# Altium project ADH_XC7Z010_SoC.PrjPcb (part 8 of 10)

## Sheet Zynq_DDR_Interface.SchDoc: Zynq DDR Interface
size A4; DrawnBy: Emre Can Damyanlı; Revision: A.1; SheetNumber: 7; SheetTotal: 8; ENG_APP_DATE: --/--/--; DSN_APP_DATE: --/--/--; CHK_APP_DATE: --/--/--
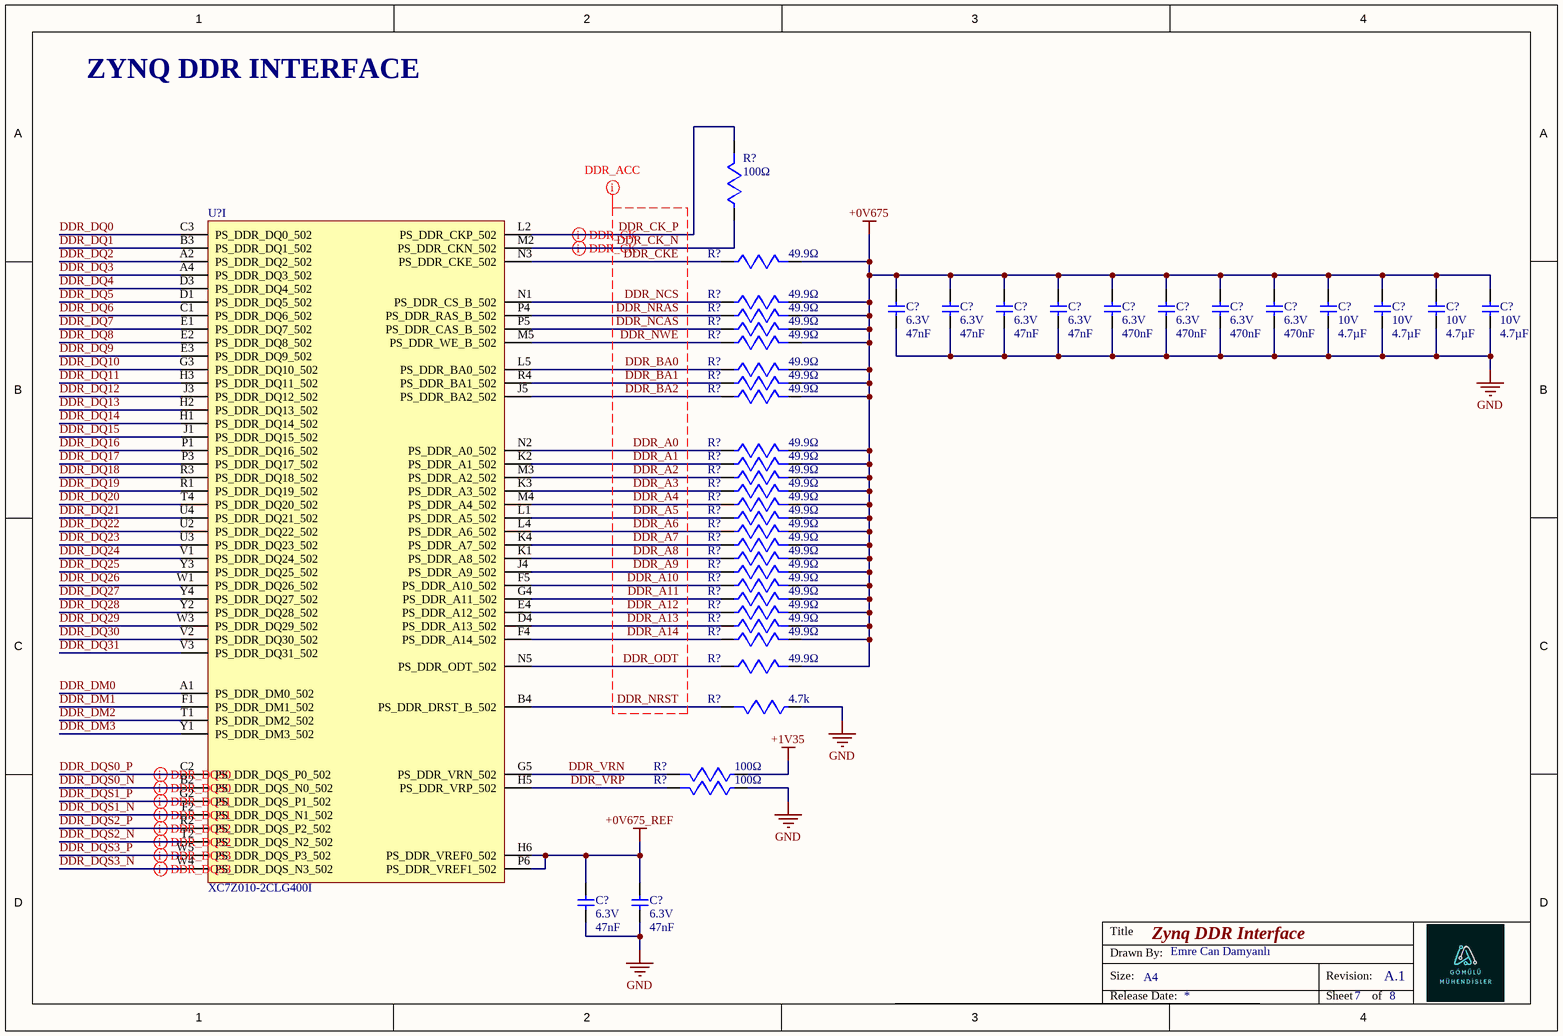
[diagram p6: Zynq_DDR_Interface.SchDoc]

### Parts
(Parts that share a designator on the sheet are numbered #1, #2 ... from top to bottom, then left to right.)
C?#129  value 47nF  Voltage Rating: 6.3V  [CAPC0603X33N]  (hidden comment: GRM033C80J473KE19D)
C?#130  value 47nF  Voltage Rating: 6.3V  [CAPC0603X33N]  (hidden comment: GRM033C80J473KE19D)
C?#131  value 47nF  Voltage Rating: 6.3V  [CAPC0603X33N]  (hidden comment: GRM033C80J473KE19D)
C?#132  value 47nF  Voltage Rating: 6.3V  [CAPC0603X33N]  (hidden comment: GRM033C80J473KE19D)
C?#133  value 470nF  Voltage Rating: 6.3V  [CAPC0603X33N]  (hidden comment: GRM033R60J474KE90D)
C?#134  value 470nF  Voltage Rating: 6.3V  [CAPC0603X33N]  (hidden comment: GRM033R60J474KE90D)
C?#135  value 470nF  Voltage Rating: 6.3V  [CAPC0603X33N]  (hidden comment: GRM033R60J474KE90D)
C?#136  value 470nF  Voltage Rating: 6.3V  [CAPC0603X33N]  (hidden comment: GRM033R60J474KE90D)
C?#137  value 4.7µF  Voltage Rating: 10V  [CAPC1005X55N]  (hidden comment: CL05A475MP5NRNC)
C?#138  value 4.7µF  Voltage Rating: 10V  [CAPC1005X55N]  (hidden comment: CL05A475MP5NRNC)
C?#139  value 4.7µF  Voltage Rating: 10V  [CAPC1005X55N]  (hidden comment: CL05A475MP5NRNC)
C?#140  value 4.7µF  Voltage Rating: 10V  [CAPC1005X55N]  (hidden comment: CL05A475MP5NRNC)
C?#141  value 47nF  Voltage Rating: 6.3V  [CAPC0603X33N]  (hidden comment: GRM033C80J473KE19D)
C?#142  value 47nF  Voltage Rating: 6.3V  [CAPC0603X33N]  (hidden comment: GRM033C80J473KE19D)
R?#106  value 100Ω  [RESISTOR_0603]  (hidden comment: RC0603FR-07100RL)
R?#107  value 49.9Ω  [RESISTOR_0603]  (hidden comment: RC0603FR-0749R9L)
R?#108  value 49.9Ω  [RESISTOR_0603]  (hidden comment: RC0603FR-0749R9L)
R?#109  value 49.9Ω  [RESISTOR_0603]  (hidden comment: RC0603FR-0749R9L)
R?#110  value 49.9Ω  [RESISTOR_0603]  (hidden comment: RC0603FR-0749R9L)
R?#111  value 49.9Ω  [RESISTOR_0603]  (hidden comment: RC0603FR-0749R9L)
R?#112  value 49.9Ω  [RESISTOR_0603]  (hidden comment: RC0603FR-0749R9L)
R?#113  value 49.9Ω  [RESISTOR_0603]  (hidden comment: RC0603FR-0749R9L)
R?#114  value 49.9Ω  [RESISTOR_0603]  (hidden comment: RC0603FR-0749R9L)
R?#115  value 49.9Ω  [RESISTOR_0603]  (hidden comment: RC0603FR-0749R9L)
R?#116  value 49.9Ω  [RESISTOR_0603]  (hidden comment: RC0603FR-0749R9L)
R?#117  value 49.9Ω  [RESISTOR_0603]  (hidden comment: RC0603FR-0749R9L)
R?#118  value 49.9Ω  [RESISTOR_0603]  (hidden comment: RC0603FR-0749R9L)
R?#119  value 49.9Ω  [RESISTOR_0603]  (hidden comment: RC0603FR-0749R9L)
R?#120  value 49.9Ω  [RESISTOR_0603]  (hidden comment: RC0603FR-0749R9L)
R?#121  value 49.9Ω  [RESISTOR_0603]  (hidden comment: RC0603FR-0749R9L)
R?#122  value 49.9Ω  [RESISTOR_0603]  (hidden comment: RC0603FR-0749R9L)
R?#123  value 49.9Ω  [RESISTOR_0603]  (hidden comment: RC0603FR-0749R9L)
R?#124  value 49.9Ω  [RESISTOR_0603]  (hidden comment: RC0603FR-0749R9L)
R?#125  value 49.9Ω  [RESISTOR_0603]  (hidden comment: RC0603FR-0749R9L)
R?#126  value 49.9Ω  [RESISTOR_0603]  (hidden comment: RC0603FR-0749R9L)
R?#127  value 49.9Ω  [RESISTOR_0603]  (hidden comment: RC0603FR-0749R9L)
R?#128  value 49.9Ω  [RESISTOR_0603]  (hidden comment: RC0603FR-0749R9L)
R?#129  value 49.9Ω  [RESISTOR_0603]  (hidden comment: RC0603FR-0749R9L)
R?#130  value 49.9Ω  [RESISTOR_0603]  (hidden comment: RC0603FR-0749R9L)
R?#131  value 4.7k  [RESISTOR_0603]  (hidden comment: RC0603FR-074K7L)
R?#132  value 100Ω  [RESISTOR_0603]  (hidden comment: RC0603FR-07100RL)
R?#133  value 100Ω  [RESISTOR_0603]  (hidden comment: RC0603FR-07100RL)
U?#22  XC7Z010-2CLG400I  [BGA400C80P20X20_1700X1700X160]  (part I of 9)

### Nets
+0V675: C?#129.2 C?#130.2 C?#131.2 C?#132.2 C?#133.2 C?#134.2 C?#135.2 C?#136.2 C?#137.2 C?#138.2 C?#139.2 C?#140.2 R?#107.2 R?#108.2 R?#109.2 R?#110.2 R?#111.2 R?#112.2 R?#113.2 R?#114.2 R?#115.2 R?#116.2 R?#117.2 R?#118.2 R?#119.2 R?#120.2 R?#121.2 R?#122.2 R?#123.2 R?#124.2 R?#125.2 R?#126.2 R?#127.2 R?#128.2 R?#129.2 R?#130.2
+0V675_REF: C?#141.2 C?#142.2 U?#22.H6(PS_DDR_VREF0_502) U?#22.P6(PS_DDR_VREF1_502)
+1V35: R?#132.1
GND: C?#129.1 C?#130.1 C?#131.1 C?#132.1 C?#133.1 C?#134.1 C?#135.1 C?#136.1 C?#137.1 C?#138.1 C?#139.1 C?#140.1 C?#141.1 C?#142.1 R?#131.1 R?#133.1
DDR_A0: R?#115.1 U?#22.N2(PS_DDR_A0_502)
DDR_A1: R?#116.1 U?#22.K2(PS_DDR_A1_502)
DDR_A2: R?#117.1 U?#22.M3(PS_DDR_A2_502)
DDR_A3: R?#118.1 U?#22.K3(PS_DDR_A3_502)
DDR_A4: R?#119.1 U?#22.M4(PS_DDR_A4_502)
DDR_A5: R?#120.1 U?#22.L1(PS_DDR_A5_502)
DDR_A6: R?#121.1 U?#22.L4(PS_DDR_A6_502)
DDR_A7: R?#122.1 U?#22.K4(PS_DDR_A7_502)
DDR_A8: R?#123.1 U?#22.K1(PS_DDR_A8_502)
DDR_A9: R?#124.1 U?#22.J4(PS_DDR_A9_502)
DDR_A10: R?#125.1 U?#22.F5(PS_DDR_A10_502)
DDR_A11: R?#126.1 U?#22.G4(PS_DDR_A11_502)
DDR_A12: R?#127.1 U?#22.E4(PS_DDR_A12_502)
DDR_A13: R?#128.1 U?#22.D4(PS_DDR_A13_502)
DDR_A14: R?#129.1 U?#22.F4(PS_DDR_A14_502)
DDR_BA0: R?#112.1 U?#22.L5(PS_DDR_BA0_502)
DDR_BA1: R?#113.1 U?#22.R4(PS_DDR_BA1_502)
DDR_BA2: R?#114.1 U?#22.J5(PS_DDR_BA2_502)
DDR_CK_N: R?#106.1 U?#22.M2(PS_DDR_CKN_502)
DDR_CK_P: R?#106.2 U?#22.L2(PS_DDR_CKP_502)
DDR_CKE: R?#107.1 U?#22.N3(PS_DDR_CKE_502)
DDR_DM0: U?#22.A1(PS_DDR_DM0_502)
DDR_DM1: U?#22.F1(PS_DDR_DM1_502)
DDR_DM2: U?#22.T1(PS_DDR_DM2_502)
DDR_DM3: U?#22.Y1(PS_DDR_DM3_502)
DDR_DQ0: U?#22.C3(PS_DDR_DQ0_502)
DDR_DQ1: U?#22.B3(PS_DDR_DQ1_502)
DDR_DQ2: U?#22.A2(PS_DDR_DQ2_502)
DDR_DQ3: U?#22.A4(PS_DDR_DQ3_502)
DDR_DQ4: U?#22.D3(PS_DDR_DQ4_502)
DDR_DQ5: U?#22.D1(PS_DDR_DQ5_502)
DDR_DQ6: U?#22.C1(PS_DDR_DQ6_502)
DDR_DQ7: U?#22.E1(PS_DDR_DQ7_502)
DDR_DQ8: U?#22.E2(PS_DDR_DQ8_502)
DDR_DQ9: U?#22.E3(PS_DDR_DQ9_502)
DDR_DQ10: U?#22.G3(PS_DDR_DQ10_502)
DDR_DQ11: U?#22.H3(PS_DDR_DQ11_502)
DDR_DQ12: U?#22.J3(PS_DDR_DQ12_502)
DDR_DQ13: U?#22.H2(PS_DDR_DQ13_502)
DDR_DQ14: U?#22.H1(PS_DDR_DQ14_502)
DDR_DQ15: U?#22.J1(PS_DDR_DQ15_502)
DDR_DQ16: U?#22.P1(PS_DDR_DQ16_502)
DDR_DQ17: U?#22.P3(PS_DDR_DQ17_502)
DDR_DQ18: U?#22.R3(PS_DDR_DQ18_502)
DDR_DQ19: U?#22.R1(PS_DDR_DQ19_502)
DDR_DQ20: U?#22.T4(PS_DDR_DQ20_502)
DDR_DQ21: U?#22.U4(PS_DDR_DQ21_502)
DDR_DQ22: U?#22.U2(PS_DDR_DQ22_502)
DDR_DQ23: U?#22.U3(PS_DDR_DQ23_502)
DDR_DQ24: U?#22.V1(PS_DDR_DQ24_502)
DDR_DQ25: U?#22.Y3(PS_DDR_DQ25_502)
DDR_DQ26: U?#22.W1(PS_DDR_DQ26_502)
DDR_DQ27: U?#22.Y4(PS_DDR_DQ27_502)
DDR_DQ28: U?#22.Y2(PS_DDR_DQ28_502)
DDR_DQ29: U?#22.W3(PS_DDR_DQ29_502)
DDR_DQ30: U?#22.V2(PS_DDR_DQ30_502)
DDR_DQ31: U?#22.V3(PS_DDR_DQ31_502)
DDR_DQS0_N: U?#22.B2(PS_DDR_DQS_N0_502)
DDR_DQS0_P: U?#22.C2(PS_DDR_DQS_P0_502)
DDR_DQS1_N: U?#22.F2(PS_DDR_DQS_N1_502)
DDR_DQS1_P: U?#22.G2(PS_DDR_DQS_P1_502)
DDR_DQS2_N: U?#22.T2(PS_DDR_DQS_N2_502)
DDR_DQS2_P: U?#22.R2(PS_DDR_DQS_P2_502)
DDR_DQS3_N: U?#22.W4(PS_DDR_DQS_N3_502)
DDR_DQS3_P: U?#22.W5(PS_DDR_DQS_P3_502)
DDR_NCAS: R?#110.1 U?#22.P5(PS_DDR_CAS_B_502)
DDR_NCS: R?#108.1 U?#22.N1(PS_DDR_CS_B_502)
DDR_NRAS: R?#109.1 U?#22.P4(PS_DDR_RAS_B_502)
DDR_NRST: R?#131.2 U?#22.B4(PS_DDR_DRST_B_502)
DDR_NWE: R?#111.1 U?#22.M5(PS_DDR_WE_B_502)
DDR_ODT: R?#130.1 U?#22.N5(PS_DDR_ODT_502)
DDR_VRN: R?#132.2 U?#22.G5(PS_DDR_VRN_502)
DDR_VRP: R?#133.2 U?#22.H5(PS_DDR_VRP_502)

### Layout directives
differential pair: DDR_CK_N, DDR_CK_P, DDR_DQS0_N, DDR_DQS0_P, DDR_DQS1_N, DDR_DQS1_P, DDR_DQS2_N, DDR_DQS2_P, DDR_DQS3_N, DDR_DQS3_P
mark named DDR_ACC: DDR_A0, DDR_A1, DDR_A2, DDR_A3, DDR_A4, DDR_A5, DDR_A6, DDR_A7, DDR_A8, DDR_A9, DDR_A10, DDR_A11, DDR_A12, DDR_A13, DDR_A14, DDR_BA0, DDR_BA1, DDR_BA2, DDR_CK_N, DDR_CK_P, DDR_CKE, DDR_NCAS, DDR_NCS, DDR_NRAS, DDR_NRST, DDR_NWE, DDR_ODT

### Notes on the sheet
- ZYNQ DDR INTERFACE
- Title
- Size:
- Drawn By:
- A4
- Revision:
- Release Date:
- Sheet
- of

### Library data of the parts
C?#129-C?#132 C?#141 C?#142 = GRM033C80J473KE19D: 6.3V 47nF X6S ±10% 0201 Multilayer Ceramic Capacitors MLCC - SMD/SMT ROHS; Manufacturer: Murata; Manufacturer Lifecycle Status: IN PRODUCTION; Supplier: Arrow Electronics; Supplier Part Number: GRM033C80J473KE19D; Manufacturer Part Number: GRM033C80J473KE19D; RoHS: Compliant; Category: Ceramic Capacitors; Stock: 1925; Pricing: 1924=0,0007 (USD); Case/Package: 0201; Case Code (Imperial): 0201; Case Code (Metric): 0603; Depth: 300µm; Dielectric: X6S; Dielectric Material: Ceramic; Height: 300µm; Lead Free: Lead Free; Length: 600µm; Lifecycle Status: Production; Material: Ceramic; Max Operating Temperature: 105°C; Min Operating Temperature: -55°C; Mounting Technology: Surface Mount; Number of Terminals: 2; Radiation Hardening: No; REACH SVHC: Yes; Schedule B: 8532240020, 8532240020|8532240020|8532240020|8532240020|8532240020; Termination: SMD/SMT; Thickness: 300µm; Tolerance: 10%; Voltage Rating (DC): 6.3V; Width: 300µm; ComponentLink1URL: https://datasheet.octopart.com:443/GRM033C80J473KE19D-Murata-datasheet-14396169.pdf?src-supplier=Future+Electronics; ComponentLink1Description: https://datasheet.octopart.com:443/GRM033C80J473KE19D-Murata-datasheet-14396169.pdf?src-supplier=Future+Electronics; ComponentLink2URL: https://datasheet.octopart.com:443/GRM033C80J473KE19D-Murata-datasheet-96971104.pdf?src-supplier=Future+Electronics; ComponentLink2Description: https://datasheet.octopart.com:443/GRM033C80J473KE19D-Murata-datasheet-96971104.pdf?src-supplier=Future+Electronics; ComponentLink3URL: https://datasheet.octopart.com:443/GRM033C80J473KE19D-Murata-datasheet-22122223.pdf?src-supplier=Future+Electronics; ComponentLink3Description: https://datasheet.octopart.com:443/GRM033C80J473KE19D-Murata-datasheet-22122223.pdf?src-supplier=Future+Electronics; ComponentLink4URL: https://datasheet.octopart.com:443/GRM033C80J473KE19D-Murata-datasheet-44105362.pdf?src-supplier=Future+Electronics; ComponentLink4Description: https://datasheet.octopart.com:443/GRM033C80J473KE19D-Murata-datasheet-44105362.pdf?src-supplier=Future+Electronics; ComponentLink5URL: https://datasheet.octopart.com:443/GRM033C80J473KE19D-Murata-datasheet-165579666.pdf?src-supplier=TME; ComponentLink5Description: https://datasheet.octopart.com:443/GRM033C80J473KE19D-Murata-datasheet-165579666.pdf?src-supplier=TME; ComponentLink6URL: https://datasheet.octopart.com:443/GRM033C80J473KE19D-Murata-datasheet-141274201.pdf?src-supplier=Ciiva; ComponentLink6Description: https://datasheet.octopart.com:443/GRM033C80J473KE19D-Murata-datasheet-141274201.pdf?src-supplier=Ciiva; ComponentLink7URL: https://datasheet.octopart.com:443/GRM033C80J473KE19D-Murata-datasheet-140675416.pdf?src-supplier=Ciiva; ComponentLink7Description: https://datasheet.octopart.com:443/GRM033C80J473KE19D-Murata-datasheet-140675416.pdf?src-supplier=Ciiva; ComponentLink8URL: https://datasheet.octopart.com:443/GRM033C80J473KE19D-Murata-datasheet-138738209.pdf?src-supplier=Ciiva; ComponentLink8Description: https://datasheet.octopart.com:443/GRM033C80J473KE19D-Murata-datasheet-138738209.pdf?src-supplier=Ciiva; ComponentLink9URL: https://datasheet.octopart.com:443/GRM033C80J473KE19D-Murata-datasheet-32479577.pdf?src-supplier=HQonline; ComponentLink9Description: https://datasheet.octopart.com:443/GRM033C80J473KE19D-Murata-datasheet-32479577.pdf?src-supplier=HQonline; ComponentLink10URL: https://datasheet.octopart.com/GRM033C80J473KE19D-Murata-datasheet-12515295.pdf; ComponentLink10Description: https://datasheet.octopart.com/GRM033C80J473KE19D-Murata-datasheet-12515295.pdf; ComponentLink11URL: https://datasheet.octopart.com/GRM033C80J473KE19D-Murata-datasheet-12510076.pdf; ComponentLink11Description: https://datasheet.octopart.com/GRM033C80J473KE19D-Murata-datasheet-12510076.pdf; ComponentLink12URL: https://datasheet.octopart.com/GRM033C80J473KE19D-Murata-datasheet-11978611.pdf; ComponentLink12Description: https://datasheet.octopart.com/GRM033C80J473KE19D-Murata-datasheet-11978611.pdf; ComponentLink13URL: https://datasheet.octopart.com/GRM033C80J473KE19D-Murata-datasheet-10025737.pdf; ComponentLink13Description: https://datasheet.octopart.com/GRM033C80J473KE19D-Murata-datasheet-10025737.pdf; ComponentLink14URL: https://datasheet.octopart.com/GRM033C80J473KE19D-Murata-datasheet-8819587.pdf; ComponentLink14Description: https://datasheet.octopart.com/GRM033C80J473KE19D-Murata-datasheet-8819587.pdf; ComponentLink15URL: https://datasheet.octopart.com:443/GRM033C80J473KE19D-Murata-datasheet-150009104.pdf?src-supplier=Arrow.cn; ComponentLink15Description: https://datasheet.octopart.com:443/GRM033C80J473KE19D-Murata-datasheet-150009104.pdf?src-supplier=Arrow.cn; ComponentLink16URL: http://sigma.octopart.com:80/reach_statement/Murata-company-16.pdf?src-supplier=Compliance+Statements; ComponentLink16Description: http://sigma.octopart.com:80/reach_statement/Murata-company-16.pdf?src-supplier=Compliance+Statements
C?#133-C?#136 = GRM033R60J474KE90D: Ceramic Capacitor, Ceramic, 6.3V, 10% +Tol, 10% -Tol, X5R, 15% TC, 0.47uF, Surface Mount, 0201; Manufacturer: Murata; Manufacturer Lifecycle Status: IN PRODUCTION; Supplier: Arrow Electronics; Supplier Part Number: GRM033R60J474KE90D; Manufacturer Part Number: GRM033R60J474KE90D; RoHS: Compliant; Category: Ceramic Capacitors; Stock: 1170000; Pricing: 15000=0,004 (USD); Case/Package: 0201; Case Code (Imperial): 0201; Case Code (Metric): 0603; Depth: 300µm; Dielectric: X5R; Dielectric Material: Ceramic; Height: 300µm; Lead Free: Lead Free; Length: 600µm; Lifecycle Status: Production; Material: Ceramic; Max Operating Temperature: 85°C; Min Operating Temperature: -55°C; Mounting Technology: Surface Mount; Number of Terminals: 2; Packaging: Tape & Reel (TR); REACH SVHC: Yes; Schedule B: 8532240020, 8532240020|8532240020, 8532240020|8532240020|8532240020, 8532240020|8532240020|8532240020|8532240020; Termination: SMD/SMT; Thickness: 300µm; Tolerance: 10%; Voltage Rating (DC): 6.3V; Weight: 340.194278µg; Width: 300µm; ComponentLink1URL: https://datasheet.octopart.com:443/GRM033R60J474KE90D-Murata-datasheet-165579666.pdf?src-supplier=TME; ComponentLink1Description: https://datasheet.octopart.com:443/GRM033R60J474KE90D-Murata-datasheet-165579666.pdf?src-supplier=TME; ComponentLink2URL: https://datasheet.octopart.com:443/GRM033R60J474KE90D-Murata-datasheet-141274201.pdf?src-supplier=Ciiva; ComponentLink2Description: https://datasheet.octopart.com:443/GRM033R60J474KE90D-Murata-datasheet-141274201.pdf?src-supplier=Ciiva; ComponentLink3URL: https://datasheet.octopart.com:443/GRM033R60J474KE90D-Murata-datasheet-140676048.pdf?src-supplier=Ciiva; ComponentLink3Description: https://datasheet.octopart.com:443/GRM033R60J474KE90D-Murata-datasheet-140676048.pdf?src-supplier=Ciiva; ComponentLink4URL: https://datasheet.octopart.com:443/GRM033R60J474KE90D-Murata-datasheet-138738366.pdf?src-supplier=Ciiva; ComponentLink4Description: https://datasheet.octopart.com:443/GRM033R60J474KE90D-Murata-datasheet-138738366.pdf?src-supplier=Ciiva; ComponentLink5URL: https://datasheet.octopart.com:443/GRM033R60J474KE90D-Murata-datasheet-22122223.pdf?src-supplier=Future+Electronics; ComponentLink5Description: https://datasheet.octopart.com:443/GRM033R60J474KE90D-Murata-datasheet-22122223.pdf?src-supplier=Future+Electronics; ComponentLink6URL: https://datasheet.octopart.com/GRM033R60J474KE90D-Murata-datasheet-12515295.pdf; ComponentLink6Description: https://datasheet.octopart.com/GRM033R60J474KE90D-Murata-datasheet-12515295.pdf; ComponentLink7URL: https://datasheet.octopart.com/GRM033R60J474KE90D-Murata-datasheet-12510076.pdf; ComponentLink7Description: https://datasheet.octopart.com/GRM033R60J474KE90D-Murata-datasheet-12510076.pdf; ComponentLink8URL: https://datasheet.octopart.com/GRM033R60J474KE90D-Murata-datasheet-11978611.pdf; ComponentLink8Description: https://datasheet.octopart.com/GRM033R60J474KE90D-Murata-datasheet-11978611.pdf; ComponentLink9URL: https://datasheet.octopart.com/GRM033R60J474KE90D-Murata-datasheet-10025737.pdf; ComponentLink9Description: https://datasheet.octopart.com/GRM033R60J474KE90D-Murata-datasheet-10025737.pdf; ComponentLink10URL: https://datasheet.octopart.com/GRM033R60J474KE90D-Murata-datasheet-8819587.pdf; ComponentLink10Description: https://datasheet.octopart.com/GRM033R60J474KE90D-Murata-datasheet-8819587.pdf; ComponentLink11URL: https://datasheet.octopart.com/GRM033R60J474KE90D-Murata-datasheet-17503195.pdf; ComponentLink11Description: https://datasheet.octopart.com/GRM033R60J474KE90D-Murata-datasheet-17503195.pdf; ComponentLink12URL: https://datasheet.octopart.com:443/GRM033R60J474KE90D-Murata-datasheet-150839311.pdf?src-supplier=Arrow.cn; ComponentLink12Description: https://datasheet.octopart.com:443/GRM033R60J474KE90D-Murata-datasheet-150839311.pdf?src-supplier=Arrow.cn; ComponentLink13URL: http://sigma.octopart.com:80/reach_statement/Murata-company-16.pdf?src-supplier=Compliance+Statements; ComponentLink13Description: http://sigma.octopart.com:80/reach_statement/Murata-company-16.pdf?src-supplier=Compliance+Statements
C?#137-C?#140 = CL05A475MP5NRNC: as C?#123-C?#125 on sheet Zynq_PS_System; Supplier: Avnet; Supplier Part Number: CL05A475MP5NRNC; Manufacturer Part Number: CL05A475MP5NRNC; RoHS: Compliant; Category: Ceramic Capacitors; Stock: 40000; Pricing: 10000=0,00671, 20000=0,00663, 40000=0,0066, 80000=0,00656, 160000=0,00653 (USD); Case/Package: 0402; Case Code (Imperial): 0402; Case Code (Metric): 1005; China RoHS: Compliant; Dielectric: X5R; Dielectric Material: Ceramic; Height: 500µm; Lead Free: Lead Free; Length: 1mm; Lifecycle Status: Production; Material: Ceramic; Max Operating Temperature: 85°C; Min Operating Temperature: -55°C; Mounting Technology: Surface Mount; Number of Terminals: 2; REACH SVHC: Yes; Schedule B: 8532240020, 8532240020|8532240020|8532240020|8532240020|8532240020|8532240020|8532240020|8532240020|8532240020|8532240020|8532240020|8532240020|8532240020|8532240020|8532240020|8532240020|8532240020|8532240020|8532240020|8532240020|8532240020|8532240020, 8532240020|8532240020|8532240020|8532240020|8532240020|8532240020|8532240020|8532240020|8532240020|8532240020|8532240020|8532240020|8532240020|8532240020|8532240020|8532240020|8532240020|8532240020|8532240020|8532240020|8532240020|8532240020|8532240020, 8532240020|8532240020|8532240020|8532240020|8532240020|8532240020|8532240020|8532240020|8532240020|8532240020|8532240020|8532240020|8532240020|8532240020|8532240020|8532240020|8532240020|8532240020|8532240020|8532240020|8532240020|8532240020|8532240020|85; Thickness: 558.8µm; Tolerance: 20%; Voltage Rating (DC): 10V; Width: 500µm; ComponentLink1URL: https://datasheet.octopart.com:443/CL05A475MP5NRNC-Samsung-Electro-Mechanics-datasheet-181551186.pdf?src-supplier=Newark; ComponentLink1Description: https://datasheet.octopart.com:443/CL05A475MP5NRNC-Samsung-Electro-Mechanics-datasheet-181551186.pdf?src-supplier=Newark; ComponentLink2URL: https://datasheet.octopart.com:443/CL05A475MP5NRNC-Samsung-Electro-Mechanics-datasheet-136482298.pdf?src-supplier=Newark; ComponentLink2Description: https://datasheet.octopart.com:443/CL05A475MP5NRNC-Samsung-Electro-Mechanics-datasheet-136482298.pdf?src-supplier=Newark; ComponentLink3URL: https://datasheet.octopart.com:443/CL05A475MP5NRNC-Samsung-Electro-Mechanics-datasheet-136031736.pdf?src-supplier=Future+Electronics; ComponentLink3Description: https://datasheet.octopart.com:443/CL05A475MP5NRNC-Samsung-Electro-Mechanics-datasheet-136031736.pdf?src-supplier=Future+Electronics; ComponentLink4URL: https://datasheet.octopart.com:443/CL05A475MP5NRNC-Samsung-Electro-Mechanics-datasheet-110226226.pdf?src-supplier=Future+Electronics; ComponentLink4Description: https://datasheet.octopart.com:443/CL05A475MP5NRNC-Samsung-Electro-Mechanics-datasheet-110226226.pdf?src-supplier=Future+Electronics; ComponentLink5URL: https://datasheet.octopart.com:443/CL05A475MP5NRNC-Samsung-Electro-Mechanics-datasheet-87580058.pdf?src-supplier=Future+Electronics; ComponentLink5Description: https://datasheet.octopart.com:443/CL05A475MP5NRNC-Samsung-Electro-Mechanics-datasheet-87580058.pdf?src-supplier=Future+Electronics; ComponentLink6URL: https://datasheet.octopart.com:443/CL05A475MP5NRNC-Samsung-Electro-Mechanics-datasheet-81461611.pdf?src-supplier=Future+Electronics; ComponentLink6Description: https://datasheet.octopart.com:443/CL05A475MP5NRNC-Samsung-Electro-Mechanics-datasheet-81461611.pdf?src-supplier=Future+Electronics; ComponentLink7URL: https://datasheet.octopart.com:443/CL05A475MP5NRNC-Samsung-datasheet-48647200.pdf?src-supplier=Future+Electronics; ComponentLink7Description: https://datasheet.octopart.com:443/CL05A475MP5NRNC-Samsung-datasheet-48647200.pdf?src-supplier=Future+Electronics; ComponentLink8URL: https://datasheet.octopart.com:443/CL05A475MP5NRNC-Samsung-datasheet-34153549.pdf?src-supplier=Future+Electronics; ComponentLink8Description: https://datasheet.octopart.com:443/CL05A475MP5NRNC-Samsung-datasheet-34153549.pdf?src-supplier=Future+Electronics; ComponentLink9URL: https://datasheet.octopart.com:443/CL05A475MP5NRNC-Samsung-datasheet-26589015.pdf?src-supplier=Future+Electronics; ComponentLink9Description: https://datasheet.octopart.com:443/CL05A475MP5NRNC-Samsung-datasheet-26589015.pdf?src-supplier=Future+Electronics; ComponentLink10URL: https://datasheet.octopart.com:443/CL05A475MP5NRNC-Samsung-datasheet-8324245.pdf?src-supplier=Future+Electronics; ComponentLink10Description: https://datasheet.octopart.com:443/CL05A475MP5NRNC-Samsung-datasheet-8324245.pdf?src-supplier=Future+Electronics; ComponentLink11URL: https://datasheet.octopart.com:443/CL05A475MP5NRNC-Samsung-Electro-Mechanics-datasheet-149136695.pdf?src-supplier=Future+Electronics; ComponentLink11Description: https://datasheet.octopart.com:443/CL05A475MP5NRNC-Samsung-Electro-Mechanics-datasheet-149136695.pdf?src-supplier=Future+Electronics; ComponentLink12URL: https://datasheet.octopart.com:443/CL05A475MP5NRNC-Samsung-datasheet-8326407.pdf?src-supplier=TME; ComponentLink12Description: https://datasheet.octopart.com:443/CL05A475MP5NRNC-Samsung-datasheet-8326407.pdf?src-supplier=TME
R?#106 R?#132 R?#133 = RC0603FR-07100RL: Yageo RC0603FR-07100RL 0603 SMD Resistor 100 Ohm thin film chip resistor; Manufacturer: Yageo Group; Power Dissipation: 100mW; Temperature Coefficient: 100ppm/°C; Tolerance: 1%; Voltage Rating: 75V; Voltage Rating (DC): 50V; Supplier: Farnell; Supplier Part Number: RC0603FR-07100RL; Manufacturer Part Number: RC0603FR-07100RL; RoHS: Compliant; Category: Chip SMD Resistors; Stock: 450350; Pricing: 10=0,0076, 100=0,0055, 500=0,0047, 1000=0,0046, 2500=0,0045 (EUR); Case/Package: 0603; Case Code (Imperial): 0603; Case Code (Metric): 0603; China RoHS: Non-Compliant; Composition: Thick Film; Depth: 800µm; Height: 450µm; Lead Free: Lead Free; Length: 1.6mm; Lifecycle Status: Production; Max Operating Temperature: 155°C; Military Standard: Not; Min Operating Temperature: -55°C; Mounting Technology: Surface Mount; Pins: 2; Number of Terminals: 2; Packaging: Cut Tape (CT); Power Rating: 100mW; REACH SVHC: Yes; Schedule B: 8533210045, 8533210045|8533210045|8533210045|8533210045|8533210045|8533210045|8533210045|8533210045|8533210045|8533210045|8533210045|8533210045|8533210045|8533210045|8533210045|8533210045|8533210045|8533210045|8533210045|8533210045|8533210045|8533210045|8533210045|85; Termination: SMD/SMT; Width: 800µm; Working Voltage: 75V; ComponentLink1URL: https://datasheet.octopart.com:443/RC0603FR-07100RL-Yageo-datasheet-175887523.pdf?src-supplier=IHS; ComponentLink1Description: https://datasheet.octopart.com:443/RC0603FR-07100RL-Yageo-datasheet-175887523.pdf?src-supplier=IHS; ComponentLink2URL: https://datasheet.octopart.com:443/RC0603FR-07100RL-Yageo-datasheet-8328172.pdf?src-supplier=Newark; ComponentLink2Description: https://datasheet.octopart.com:443/RC0603FR-07100RL-Yageo-datasheet-8328172.pdf?src-supplier=Newark; ComponentLink3URL: https://datasheet.octopart.com:443/RC0603FR-07100RL-Yageo-datasheet-34211833.pdf?src-supplier=Newark; ComponentLink3Description: https://datasheet.octopart.com:443/RC0603FR-07100RL-Yageo-datasheet-34211833.pdf?src-supplier=Newark; ComponentLink4URL: https://datasheet.octopart.com:443/RC0603FR-07100RL-Yageo-datasheet-103092701.pdf?src-supplier=Upverter; ComponentLink4Description: https://datasheet.octopart.com:443/RC0603FR-07100RL-Yageo-datasheet-103092701.pdf?src-supplier=Upverter; ComponentLink5URL: https://datasheet.octopart.com:443/RC0603FR-07100RL-Yageo-datasheet-62067350.pdf?src-supplier=element14+APAC; ComponentLink5Description: https://datasheet.octopart.com:443/RC0603FR-07100RL-Yageo-datasheet-62067350.pdf?src-supplier=element14+APAC; ComponentLink6URL: https://datasheet.octopart.com:443/RC0603FR-07100RL-Yageo-datasheet-17842380.pdf?src-supplier=element14+APAC; ComponentLink6Description: https://datasheet.octopart.com:443/RC0603FR-07100RL-Yageo-datasheet-17842380.pdf?src-supplier=element14+APAC; ComponentLink7URL: https://datasheet.octopart.com:443/RC0603FR-07100RL-Yageo-datasheet-12596169.pdf?src-supplier=Future+Electronics; ComponentLink7Description: https://datasheet.octopart.com:443/RC0603FR-07100RL-Yageo-datasheet-12596169.pdf?src-supplier=Future+Electronics; ComponentLink8URL: https://datasheet.octopart.com:443/RC0603FR-07100RL-Yageo-Group-datasheet-176638170.pdf?src-supplier=Future+Electronics; ComponentLink8Description: https://datasheet.octopart.com:443/RC0603FR-07100RL-Yageo-Group-datasheet-176638170.pdf?src-supplier=Future+Electronics; ComponentLink9URL: https://datasheet.octopart.com:443/RC0603FR-07100RL-Yageo-datasheet-164759695.pdf?src-supplier=Future+Electronics; ComponentLink9Description: https://datasheet.octopart.com:443/RC0603FR-07100RL-Yageo-datasheet-164759695.pdf?src-supplier=Future+Electronics; ComponentLink10URL: https://datasheet.octopart.com:443/RC0603FR-07100RL-Yageo-datasheet-137700087.pdf?src-supplier=Future+Electronics; ComponentLink10Description: https://datasheet.octopart.com:443/RC0603FR-07100RL-Yageo-datasheet-137700087.pdf?src-supplier=Future+Electronics; ComponentLink11URL: https://datasheet.octopart.com:443/RC0603FR07100RL-Yageo-datasheet-27584510.pdf?src-supplier=Future+Electronics; ComponentLink11Description: https://datasheet.octopart.com:443/RC0603FR07100RL-Yageo-datasheet-27584510.pdf?src-supplier=Future+Electronics; ComponentLink12URL: https://datasheet.octopart.com:443/RC0603FR-07100RL-Yageo-datasheet-15599030.pdf?src-supplier=Future+Electronics; ComponentLink12Description: https://datasheet.octopart.com:443/RC0603FR-07100RL-Yageo-datasheet-15599030.pdf?src-supplier=Future+Electronics; ComponentLink13URL: https://datasheet.octopart.com:443/RC0603FR-07100RL-Yageo-datasheet-8324193.pdf?src-supplier=Future+Electronics; ComponentLink13Description: https://datasheet.octopart.com:443/RC0603FR-07100RL-Yageo-datasheet-8324193.pdf?src-supplier=Future+Electronics; ComponentLink14URL: https://datasheet.octopart.com:443/RC0603FR-07100RL-Yageo-datasheet-79472498.pdf?src-supplier=Megastar; ComponentLink14Description: https://datasheet.octopart.com:443/RC0603FR-07100RL-Yageo-datasheet-79472498.pdf?src-supplier=Megastar; ComponentLink15URL: https://datasheet.octopart.com/RC0603FR-07100RL-Yageo-datasheet-73766026.pdf; ComponentLink15Description: https://datasheet.octopart.com/RC0603FR-07100RL-Yageo-datasheet-73766026.pdf; ComponentLink16URL: https://datasheet.octopart.com:443/RC0603FR-07100RL-Yageo-datasheet-13691069.pdf?src-supplier=Farnell; ComponentLink16Description: https://datasheet.octopart.com:443/RC0603FR-07100RL-Yageo-datasheet-13691069.pdf?src-supplier=Farnell; ComponentLink17URL: https://datasheet.octopart.com:443/RC0603FR-07100RL-Yageo-datasheet-118562.pdf?src-supplier=DigiKey; ComponentLink17Description: https://datasheet.octopart.com:443/RC0603FR-07100RL-Yageo-datasheet-118562.pdf?src-supplier=DigiKey; ComponentLink18URL: http://sigma.octopart.com:80/conflict_mineral_statement/Yageo-company-3.pdf?src-supplier=Compliance+Statements; ComponentLink18Description: http://sigma.octopart.com:80/conflict_mineral_statement/Yageo-company-3.pdf?src-supplier=Compliance+Statements; ComponentLink19URL: http://sigma.octopart.com:80/rohs_statement/Yageo-company-2.pdf?src-supplier=Compliance+Statements; ComponentLink19Description: http://sigma.octopart.com:80/rohs_statement/Yageo-company-2.pdf?src-supplier=Compliance+Statements
R?#107-R?#130 = RC0603FR-0749R9L: 100mW Thick Film Resistors 75V ±100ppm/℃ ±1% 49.9Ω 0603 Chip Resistor - Surface Mount ROHS; Manufacturer: Yageo Group; Interface: SPI; Max Supply Voltage: 3.63V; Min Supply Voltage: 2.97V; Temperature Coefficient: 100ppm/°C; Voltage Rating (DC): 50V; Supplier: Farnell; Supplier Part Number: RC0603FR-0749R9L; Manufacturer Part Number: RC0603FR-0749R9L; RoHS: Compliant; Category: Chip SMD Resistors; Stock: 678097; Pricing: 500=0,005, 1000=0,0048, 2500=0,0037 (EUR); Case/Package: 0603; Case Code (Imperial): 0603; China RoHS: Non-Compliant; Composition: Thick Film; Country of Origin: Mainland China, Taiwan; Depth: 800µm; Export Control Classification Number (ECCN) Code: EAR99; Height: 450µm; Harmonized Tariff Schedule (HTS) Code: 8533.21.00.30; Introduction Date: 2004-09-22; Lead Free: Lead Free; Length: 1.6mm; Lifecycle Status: Production; Max Operating Temperature: 155°C; Military Standard: Not; Min Operating Temperature: -55°C; Mounting Technology: Surface Mount; Pins: 2; Number of Terminals: 2; Packaging: Tape & Reel; Power Dissipation: 100mW; Power Rating: 100mW; REACH SVHC: Yes; Schedule B: 8533210045, 8533210045|8533210045, 8533210045|8533210045|8533210045, 8533210045|8533210045|8533210045|8533210045; Termination: SMD/SMT; Tolerance: 1%; Voltage Rating: 75V; Width: 800µm; Working Voltage: 75V; ComponentLink1URL: https://datasheet.octopart.com:443/RC0603FR-0749R9L-Yageo-datasheet-175887523.pdf?src-supplier=IHS; ComponentLink1Description: https://datasheet.octopart.com:443/RC0603FR-0749R9L-Yageo-datasheet-175887523.pdf?src-supplier=IHS; ComponentLink2URL: https://datasheet.octopart.com:443/RC0603FR-0749R9L-Yageo-datasheet-8328172.pdf?src-supplier=Burklin+Elektronik; ComponentLink2Description: https://datasheet.octopart.com:443/RC0603FR-0749R9L-Yageo-datasheet-8328172.pdf?src-supplier=Burklin+Elektronik; ComponentLink3URL: https://datasheet.octopart.com:443/RC0603FR-0749R9L-Yageo-datasheet-103092701.pdf?src-supplier=Upverter; ComponentLink3Description: https://datasheet.octopart.com:443/RC0603FR-0749R9L-Yageo-datasheet-103092701.pdf?src-supplier=Upverter; ComponentLink4URL: https://datasheet.octopart.com:443/RC0603FR-0749R9L-Yageo-datasheet-98239111.pdf?src-supplier=Upverter; ComponentLink4Description: https://datasheet.octopart.com:443/RC0603FR-0749R9L-Yageo-datasheet-98239111.pdf?src-supplier=Upverter; ComponentLink5URL: https://datasheet.octopart.com:443/RC0603FR-0749R9L-Yageo-Group-datasheet-190305687.pdf?src-supplier=Future+Electronics; ComponentLink5Description: https://datasheet.octopart.com:443/RC0603FR-0749R9L-Yageo-Group-datasheet-190305687.pdf?src-supplier=Future+Electronics; ComponentLink6URL: https://datasheet.octopart.com:443/RC0603FR-0749R9L-Yageo-datasheet-164759695.pdf?src-supplier=Future+Electronics; ComponentLink6Description: https://datasheet.octopart.com:443/RC0603FR-0749R9L-Yageo-datasheet-164759695.pdf?src-supplier=Future+Electronics; ComponentLink7URL: https://datasheet.octopart.com:443/RC0603FR-0749R9L-Yageo-datasheet-137700087.pdf?src-supplier=Future+Electronics; ComponentLink7Description: https://datasheet.octopart.com:443/RC0603FR-0749R9L-Yageo-datasheet-137700087.pdf?src-supplier=Future+Electronics; ComponentLink8URL: https://datasheet.octopart.com:443/RC0603FR-0749R9L-Yageo-datasheet-12596169.pdf?src-supplier=Future+Electronics; ComponentLink8Description: https://datasheet.octopart.com:443/RC0603FR-0749R9L-Yageo-datasheet-12596169.pdf?src-supplier=Future+Electronics; ComponentLink9URL: https://datasheet.octopart.com:443/RC0603FR-0749R9L-Yageo-datasheet-503470.pdf?src-supplier=Future+Electronics; ComponentLink9Description: https://datasheet.octopart.com:443/RC0603FR-0749R9L-Yageo-datasheet-503470.pdf?src-supplier=Future+Electronics; ComponentLink10URL: https://datasheet.octopart.com:443/RC0603FR-0749R9L-Yageo-datasheet-34211833.pdf?src-supplier=element14+APAC; ComponentLink10Description: https://datasheet.octopart.com:443/RC0603FR-0749R9L-Yageo-datasheet-34211833.pdf?src-supplier=element14+APAC; ComponentLink11URL: https://datasheet.octopart.com:443/RC0603FR-0749R9L-Yageo-datasheet-62067350.pdf?src-supplier=Farnell; ComponentLink11Description: https://datasheet.octopart.com:443/RC0603FR-0749R9L-Yageo-datasheet-62067350.pdf?src-supplier=Farnell; ComponentLink12URL: https://datasheet.octopart.com:443/RC0603FR-0749R9L-Yageo-datasheet-15599030.pdf?src-supplier=Seeed+Studio; ComponentLink12Description: https://datasheet.octopart.com:443/RC0603FR-0749R9L-Yageo-datasheet-15599030.pdf?src-supplier=Seeed+Studio; ComponentLink13URL: https://datasheet.octopart.com:443/RC0603FR-0749R9L-Yageo-Group-datasheet-176638170.pdf?src-supplier=Newark; ComponentLink13Description: https://datasheet.octopart.com:443/RC0603FR-0749R9L-Yageo-Group-datasheet-176638170.pdf?src-supplier=Newark; ComponentLink14URL: https://datasheet.octopart.com:443/RC0603FR-0749R9L-Yageo-datasheet-79472498.pdf?src-supplier=Megastar; ComponentLink14Description: https://datasheet.octopart.com:443/RC0603FR-0749R9L-Yageo-datasheet-79472498.pdf?src-supplier=Megastar; ComponentLink15URL: https://datasheet.octopart.com/RC0603FR-0749R9L-Yageo-datasheet-73766026.pdf; ComponentLink15Description: https://datasheet.octopart.com/RC0603FR-0749R9L-Yageo-datasheet-73766026.pdf; ComponentLink16URL: https://datasheet.octopart.com:443/RC0603FR-0749R9L-Yageo-datasheet-118562.pdf?src-supplier=DigiKey; ComponentLink16Description: https://datasheet.octopart.com:443/RC0603FR-0749R9L-Yageo-datasheet-118562.pdf?src-supplier=DigiKey; ComponentLink17URL: http://sigma.octopart.com:80/conflict_mineral_statement/Yageo-company-3.pdf?src-supplier=Compliance+Statements; ComponentLink17Description: http://sigma.octopart.com:80/conflict_mineral_statement/Yageo-company-3.pdf?src-supplier=Compliance+Statements; ComponentLink18URL: http://sigma.octopart.com:80/rohs_statement/Yageo-company-2.pdf?src-supplier=Compliance+Statements; ComponentLink18Description: http://sigma.octopart.com:80/rohs_statement/Yageo-company-2.pdf?src-supplier=Compliance+Statements
R?#131 = RC0603FR-074K7L: SMD Chip Resistor, 4.7 kOhm, ± 1%, 100 mW, 0603 [1608 Metric], Thick Film, General Purpose; Manufacturer: Yageo; Power Rating: 100mW; Voltage Rating (DC): 50V; Temperature Coefficient: 100ppm/°C; Supplier: Digi-Key; Supplier Part Number: 311-4.70KHRCT-ND; Manufacturer Part Number: RC0603FR-074K7L; RoHS: Yes; Category: Chip SMD Resistors; Stock: 7233601; Pricing: 1=0,1, 10=0,018, 50=0,0106, 100=0,0088, 500=0,00592, 1000=0,00505 (USD); Case/Package: 0603; Pins: 2; Case Code (Imperial): 0603; Case Code (Metric): 1608; Min Operating Temperature: -55°C; Max Operating Temperature: 155°C; Tolerance: 1%; Resistor Type: Thick Film; Packaging: Tape and Reel; Voltage Rating: 50V; Termination: SMD/SMT; Features: Moisture Resistant; Series: RC; Max Power Dissipation: 100mW; Number of Terminations: 2; Construction: Rectangular; Resistance Tolerance: 1%; Length: 1.6mm; Width: 0.8mm; Depth: 0.8mm; Lead Pitch: 0.3mm; Lead Free: Lead Free; Reach SVHC Compliant: Unknown; RoHS Compliant: Yes; Military Standard: Not; ComponentLink1URL: https://datasheet.ciiva.com/15189/getdatasheetpartid-422754-15189760.pdf?src-supplier=Verical; ComponentLink1Description: https://datasheet.ciiva.com/15189/getdatasheetpartid-422754-15189760.pdf?src-supplier=Verical; ComponentLink2URL: https://datasheet.ciiva.com/7660/38590-7660794.pdf?src-supplier=Element14; ComponentLink2Description: https://datasheet.ciiva.com/7660/38590-7660794.pdf?src-supplier=Element14; ComponentLink3URL: https://datasheet.ciiva.com/22747/443971-22747528.pdf?src-supplier=Element14; ComponentLink3Description: https://datasheet.ciiva.com/22747/443971-22747528.pdf?src-supplier=Element14; ComponentLink4URL: https://datasheet.ciiva.com/46440/1868787-46440909.pdf?src-supplier=Element14; ComponentLink4Description: https://datasheet.ciiva.com/46440/1868787-46440909.pdf?src-supplier=Element14; ComponentLink5URL: https://datasheet.ciiva.com/7746/1868787-7746365.pdf?src-supplier=Element14; ComponentLink5Description: https://datasheet.ciiva.com/7746/1868787-7746365.pdf?src-supplier=Element14; ComponentLink6URL: https://datasheet.ciiva.com/7746/1738695-7746366.pdf?src-supplier=Element14; ComponentLink6Description: https://datasheet.ciiva.com/7746/1738695-7746366.pdf?src-supplier=Element14
U?#22 = XC7Z010-2CLG400I: MPU Zynq-7000 Thumb-2 32-Bit 733MHz 1.2V/3.3V 400-Pin CS-BGA; Manufacturer: AMD; Core Architecture: ARM; Data Bus Width: 32b; Frequency: 766MHz; Interface: CAN, EBI/EMI, Ethernet, I2C, MMC, SD, SDIO, SPI, UART, USART, USB; Max Supply Voltage: 1.05V; Min Supply Voltage: 950mV; Number of I/Os: 130; Operating Supply Voltage: 1V; Peripherals: DMA; Speed Grade: -2; Supplier: Farnell; Supplier Part Number: 2831085; Manufacturer Part Number: XC7Z010-2CLG400I; RoHS: Compliant; Category: System on Chip (SoC); Stock: 89; Pricing: 1=78,2 (EUR); Case/Package: BGA; China RoHS: Compliant; Contact Plating: Copper, Silver, Tin; Height - Seated (Max): 1.6mm; Length: 17mm; Lifecycle Status: Production; Clock Frequency: 733MHz; Max Operating Temperature: 100°C; Min Operating Temperature: -40°C; Pins: 400; Number of Terminals: 400; Radiation Hardening: No; REACH SVHC: Yes; Terminal Pitch: 800µm; Width: 17mm; ComponentLink1URL: https://datasheet.octopart.com:443/XC7Z010-2CLG400I-AMD-datasheet-159618399.pdf?src-supplier=IHS; ComponentLink1Description: https://datasheet.octopart.com:443/XC7Z010-2CLG400I-AMD-datasheet-159618399.pdf?src-supplier=IHS; ComponentLink2URL: https://datasheet.octopart.com:443/XC7Z010-2CLG400I-Xilinx-datasheet-134531205.pdf?src-supplier=Upverter; ComponentLink2Description: https://datasheet.octopart.com:443/XC7Z010-2CLG400I-Xilinx-datasheet-134531205.pdf?src-supplier=Upverter; ComponentLink3URL: https://datasheet.octopart.com:443/XC7Z010-2CLG400I-AMD-datasheet-101617038.pdf?src-supplier=Farnell; ComponentLink3Description: https://datasheet.octopart.com:443/XC7Z010-2CLG400I-AMD-datasheet-101617038.pdf?src-supplier=Farnell; ComponentLink4URL: https://datasheet.octopart.com:443/XC7Z010-2CLG400I-Xilinx-datasheet-159009919.pdf?src-supplier=Augswan; ComponentLink4Description: https://datasheet.octopart.com:443/XC7Z010-2CLG400I-Xilinx-datasheet-159009919.pdf?src-supplier=Augswan